# EAGLE schematic MagRes Sensor (EAGLE 7.5.0)
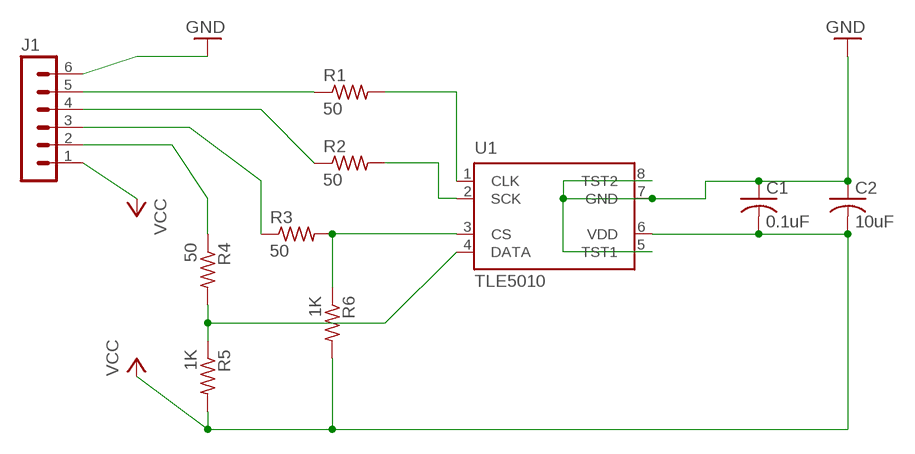
[diagram p0: schematic, sheet 1]

## Parts
C1  0.1uF  C-USC1206  [C1206]
C2  10uF  C-USC1206  [C1206]
J1  MA06-1  [MA06-1]
R1  50  R-US_R1206  [R1206]
R2  50  R-US_R1206  [R1206]
R3  50  R-US_R1206  [R1206]
R4  50  R-US_R1206  [R1206]
R5  1K  R-US_R1206  [R1206]
R6  1K  R-US_R1206  [R1206]
U1  TLE5010  [PG-DSO-8]

## Nets
GND: C1.1 C2.1 J1.6 U1.5(TST1) U1.7(GND) U1.8(TST2)
N$1: R1.2 U1.1(CLK)
N$2: R2.2 U1.2(SCK)
N$3: J1.5 R1.1
N$4: J1.4 R2.1
N$5: J1.3 R3.1
N$6: R3.2 R6.1 U1.3(CS)
N$7: R4.2 R5.1 U1.4(DATA)
N$11: J1.2 R4.1
VCC: C1.2 C2.2 J1.1 R5.2 R6.2 U1.6(VDD)

## Library data of the parts
C1 C2 = resistor:C-US: CAPACITOR, American symbol
J1 = con-lstb:MA06-1: PIN HEADER; OC_FARNELL: unknown; OC_NEWARK: unknown
R1-R6 = resistor:R-US_: RESISTOR, American symbol
U1 = infineon:TLE5010: TLE5010 GMR Angular Sensor VDD 5.0V Angle Range 0–360